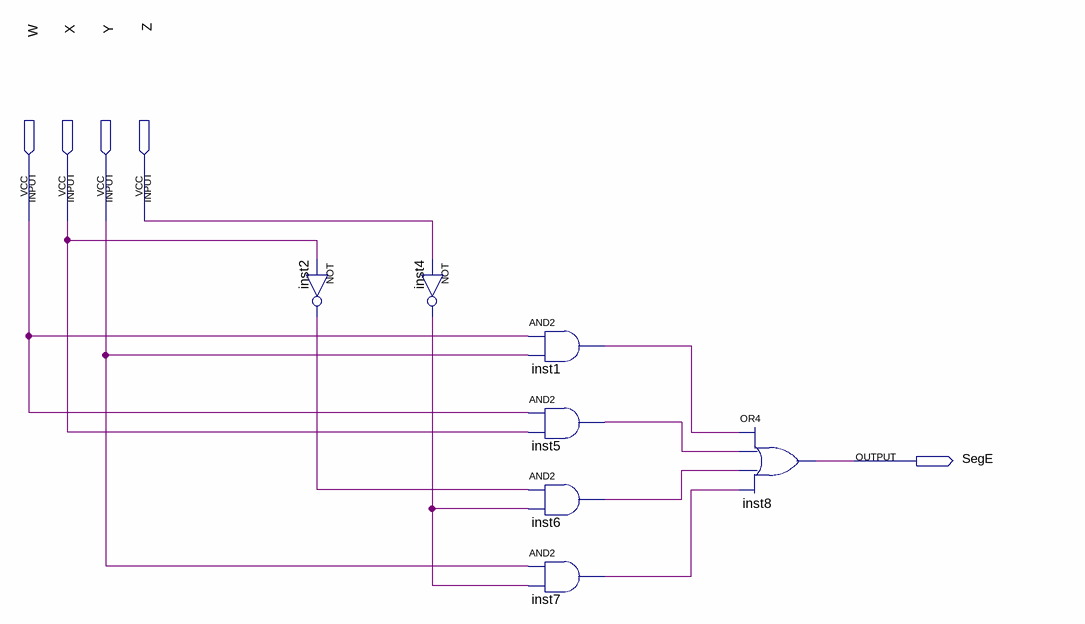
[diagram p0: schematic sheet]
// Quartus schematic SegE.bdf as structural Verilog: 7 symbols, 5 pins
module SegE (
  input  W,
  input  X,
  input  Y,
  input  Z,
  output SegE
);

  wire inst1_out, inst2_out, inst4_out, inst5_out, inst6_out, inst7_out;

  not inst2 (inst2_out, X);
  not inst4 (inst4_out, Z);
  and inst1 (inst1_out, W, Y);
  and inst5 (inst5_out, W, X);
  and inst6 (inst6_out, inst2_out, inst4_out);
  and inst7 (inst7_out, Y, inst4_out);
  or inst8 (SegE, inst1_out, inst5_out, inst6_out, inst7_out);
endmodule
